# Altium schematic sheet Power.SchDoc
size A4
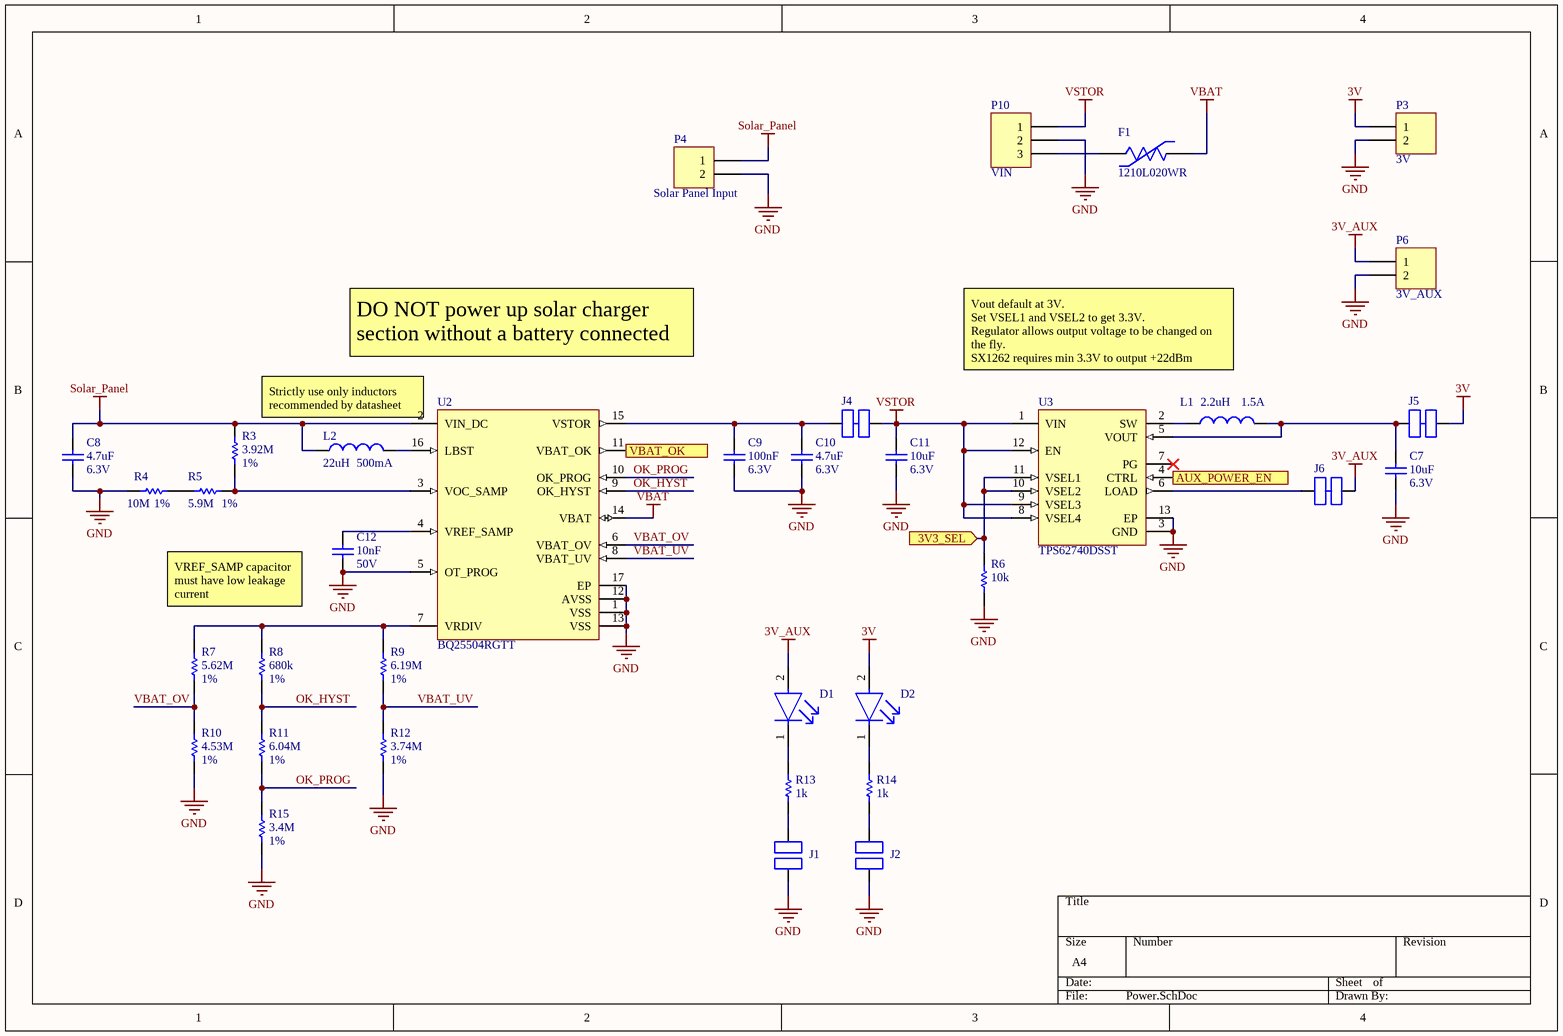
[diagram p0: Power.SchDoc]

## Parts
C7  value 10uF  Voltage: 6.3V  [0603 (1608M)]  (hidden comment: Cap)
C8  value 4.7uF  Voltage: 6.3V  [0603 (1608M)]  (hidden comment: Cap)
C9  value 100nF  Voltage: 6.3V  [0603 (1608M)]  (hidden comment: Cap)
C10  value 4.7uF  Voltage: 6.3V  [0603 (1608M)]  (hidden comment: Cap)
C11  value 10uF  Voltage: 6.3V  [0603 (1608M)]  (hidden comment: Cap)
C12  value 10nF  Voltage: 50V  [0603 (1608M)]  (hidden comment: Cap)
D1  SML-D12P8WT86  [FP-SML-D12-MFG]  (value not drawn)
D2  SML-D12P8WT86  [FP-SML-D12-MFG]  (value not drawn)
F1  1210L020WR  [FP-1210L-MFG]
J1  Open Jumper  [Jumper (Open)]  (value not drawn)  (no BOM)
J2  Open Jumper  [Jumper (Open)]  (value not drawn)  (no BOM)
J4  Closed Jumper  [Jumper (Close)]  (value not drawn)  (net tie, no BOM)
J5  Closed Jumper  [Jumper (Close)]  (value not drawn)  (net tie, no BOM)
J6  Closed Jumper  [Jumper (Close)]  (value not drawn)  (net tie, no BOM)
L1  Parameter 1: 2.2uH  Parameter 2: 1.5A  [SMD-1008]  (hidden comment: 74479787222)
L2  Inductance: 22uH  Current: 500mA  [WE-TPC 2828]  (hidden comment: 744025220)
P3  3V  [HDR1X2]
P4  Solar Panel Input  [HDR1X2]
P6  3V_AUX  [HDR1X2]
P10  VIN  [HDR1X3]
R3  value 3.92M  Tolerance: 1%  [0603 (1608M)]  (hidden comment: Resistor)
R4  value 10M  Tolerance: 1%  [0603 (1608M)]  (hidden comment: Resistor)
R5  value 5.9M  Tolerance: 1%  [0603 (1608M)]  (hidden comment: Resistor)
R6  value 10k  [0603 (1608M)]  (hidden comment: Resistor)
R7  value 5.62M  Tolerance: 1%  [0603 (1608M)]  (hidden comment: Resistor)
R8  value 680k  Tolerance: 1%  [0603 (1608M)]  (hidden comment: Resistor)
R9  value 6.19M  Tolerance: 1%  [0603 (1608M)]  (hidden comment: Resistor)
R10  value 4.53M  Tolerance: 1%  [0603 (1608M)]  (hidden comment: Resistor)
R11  value 6.04M  Tolerance: 1%  [0603 (1608M)]  (hidden comment: Resistor)
R12  value 3.74M  Tolerance: 1%  [0603 (1608M)]  (hidden comment: Resistor)
R13  value 1k  [0603 (1608M)]  (hidden comment: Resistor)
R14  value 1k  [0603 (1608M)]  (hidden comment: Resistor)
R15  value 3.4M  Tolerance: 1%  [0603 (1608M)]  (hidden comment: Resistor)
U2  BQ25504RGTT  [RGT0016C_V]
U3  TPS62740DSST  [DSS0012A_V]

## Ports
3V3_SEL (in), AUX_POWER_EN (in), VBAT_OK (out)

## Nets
3V: D2.2(A) J5.2 P3.1
3V_AUX: D1.2(A) J6.2 P6.1
GND: C7.1 C8.1 C9.1 C10.1 C11.1 C12.1 J1.1 J2.1 P3.2 P4.2 P6.2 P10.2 R4.1 R6.1 R10.1 R12.1 R15.1 U2.1(VSS) U2.5(OT_PROG) U2.12(AVSS) U2.13(VSS) U2.17(EP) U3.3(GND) U3.13(EP)
Solar_Panel: C8.2 L2.1 P4.1 R3.2 U2.2(VIN_DC)
VBAT: F1.2 U2.14(VBAT)
VSTOR: C11.2 J4.2 P10.1 U3.1(VIN) U3.8(VSEL4) U3.9(VSEL3) U3.12(EN)
3V3_SEL: R6.2 U3.10(VSEL2) U3.11(VSEL1) ; port 3V3_SEL
AUX_POWER_EN: U3.4(CTRL) ; port AUX_POWER_EN
OK_HYST: R8.1 R11.2 U2.9(OK_HYST)
OK_PROG: R11.1 R15.2 U2.10(OK_PROG)
VBAT_OK: U2.11(VBAT_OK) ; port VBAT_OK
VBAT_OV: R7.1 R10.2 U2.6(VBAT_OV)
VBAT_UV: R9.1 R12.2 U2.8(VBAT_UV)
NetC7_2: C7.2 J5.1 L1.2 U3.5(VOUT)
NetC9_2: C9.2 C10.2 J4.1 U2.15(VSTOR)
NetC12_2: C12.2 U2.4(VREF_SAMP)
NetD1_1: D1.1(C) R13.2
NetD2_1: D2.1(C) R14.2
NetF1_1: F1.1 P10.3
NetJ1_2: J1.2 R13.1
NetJ2_2: J2.2 R14.1
NetJ6_1: J6.1 U3.6(LOAD)
NetL1_1: L1.1 U3.2(SW)
NetL2_2: L2.2 U2.16(LBST)
NetR3_1: R3.1 R5.2 U2.3(VOC_SAMP)
NetR4_2: R4.2 R5.1
NetR7_2: R7.2 R8.2 R9.2 U2.7(VRDIV)

Not connected (* = marked no-connect by the designer): U3 7(PG)*

## Notes on the sheet
- DO NOT power up solar charger section without a battery connected
- Vout default at 3V.
  Set VSEL1 and VSEL2 to get 3.3V.
  Regulator allows output voltage to be changed on the fly.
  SX1262 requires min 3.3V to output +22dBm
- (near U2) Strictly use only inductors recommended by datasheet
- VREF_SAMP capacitor must have low leakage current

## Library data of the parts
C7-C12 = Cap: Capacitor
D1 D2 = CMP-08952-000019-1: LED GREEN DIFFUSED 0603 SMD; Manufacturer: Rohm; Forward Current: 20mA; Luminous Intensity: 6.3mcd; Led Orientation: Top View; Forward Voltage: 2.2V; Power Dissipation: 54mW; Reverse Voltage: 5V; Wavelength: 560nm; Colour: Green; Temperature Range Low: -40°C; ComponentLink2URL: https://d1d2qsbl8m0m72.cloudfront.net/en/products/databook/datasheet/opto/led/chip_mono/sml-d12x8_d13x8-e.pdf; Category: Diode; Device Class L2: LEDs; Package: SML-D12; Digikey Description: LED GREEN DIFFUSED 0603 SMD; Mouser Description: SML-D12 Series Green 0603 Diffused 6.3 mcd 2.2 V Surface Mount LED; RoHS: TRUE; Temperature Range High: +85°C; Octopart: https://octopart.com/sml-d12p8wt86-rohm-9289138; Height: 0.65mm; Lead Free: Yes; Device Class L1: Optoelectronics; ComponentLink2Description: Datasheet; Manufacturer Part Number: SML-D12P8WT86; Temperature: -40°C to +85°C; Device Class L3: unset; Automotive: No
F1 = CMP-08606-000032-1: PTC RESET FUSE 30V 200MA 1210; Manufacturer: Littelfuse; Resistance: 0.8-5Ω; Hold Current: 0.2A; Trip Time: 0.02s; Value: 0.8-5Ω; Description: PTC Resettable Fuse 0.2A(hold) 0.4A(trip) 30VDC 10A 0.6W 0.02s 0.8Ohm SMD Solder Pad 1210 T/R; Trip Current: 0.4A; Current Rating: 10A; Device Class L3: unset; Voltage Rating: 30V; Mouser Description: PTC Resettable Fuse 0.2A(hold) 0.4A(trip) 30VDC 10A 0.6W 0.02s 0.8Ohm SMD Solder Pad 1210 T/R; RoHS: TRUE; Height: 1mm; Manufacturer Part Number: 1210L020WR; Digikey Description: PTC RESET FUSE 30V 200MA 1210; Device Class L1: Circuit Protection; Temperature Range High: +85°C; Temperature: -40°C to +85°C; Temperature Range Low: -40°C; Lead Free: Yes; Automotive: No; Package: 1210L; ComponentLink2URL: https://m.littelfuse.com/~/media/electronics/datasheets/resettable_ptcs/littelfuse_ptc_1210l_datasheet.pdf.pdf; Ambient Temperature Range High: +85°C; Device Class L2: PTC Resettable Fuses; Octopart: https://octopart.com/1210l020wr-littelfuse-673644; Ambient Temperature Range Low: -40°C; Category: Fuse; ComponentLink2Description: Datasheet
J1 J2 = Jumper (Open)
J4-J6 = Jumper (Closed)
L1 = CMP-1392-00018-1: Power Multilayer Inductor WE-PMI, L=2.20 µH; Manufacturer: Wuerth Elektronik; Inductance: 2.20 ÂµH; PackageReference: SMD-1008; ComponentLink1Description: Manufacturer URL; ComponentLink1URL: http://www.we-online.com; ComponentLink2URL: http://www.we-online.de/katalog/media/pdf/74479787222A.pdf; ComponentLink2Description: Datasheet; PartNumber: 74479787222
L2 = CMP-1479-00015-1: SMD Shielded Tiny Power Inductor WE-TPC, L=22.0 µH /; Manufacturer: Wuerth Elektronik; Inductance: 22.0 ÂµH; PackageReference: WE-TPC 2828; ComponentLink2URL: http://www.we-online.de/katalog/media/pdf/744025220.pdf; ComponentLink1Description: Manufacturer URL; PartNumber: 744025220; ComponentLink1URL: http://www.we-online.com; ComponentLink2Description: Datasheet
P3 P6 = Header 2: Header, 2-Pin; LatestRevisionDate: 17-Jul-2002; LatestRevisionNote: Re-released for DXP Platform.; Publisher: Altium Limited
P4 = Header 2: LatestRevisionDate: 17-Jul-2002; LatestRevisionNote: Re-released for DXP Platform.; Publisher: Altium Limited
P10 = Header 3: Header, 3-Pin; LatestRevisionDate: 17-Jul-2002; LatestRevisionNote: Re-released for DXP Platform.; Publisher: Altium Limited
R6 R13 R14 = Resistor: Tolerance: 5%; Published: 8-Jun-2000; LatestRevisionDate: 17-Jul-2002; LatestRevisionNote: Re-released for DXP Platform.; PackageReference: AXIAL-0.3; Publisher: Altium Limited; PackageDescription: Axial Device, Thru-Hole; 2 Leads; 0.3 in Pin Spacing
U2 = CMP-0321-00258-2: Ultra Low Power Boost Converter with Battery Management for Energy Harvester App, 0.13 V, -40 to 85 degC, 16-pin QFN (RGT), Green (RoHS & no Sb/Br); Manufacturer: Texas Instruments; Li-Ion: N; SubFamily: Battery Charge Management; Vin(Min)(V): 0.13; ComponentLink1URL: http://www.ti.com/general/docs/lit/getliterature.tsp?genericPartNumber=BQ25504&fileType=pdf; ComponentLink1Description: Datasheet; PartNumber: BQ25504RGTT; DatasheetVersion: SLUSAH0; PackageVersion: revH, Oct-2011; Lead Acid: N; PackageDescription: 16-Pin Plastic Quad Flat No-Lead, 3 x 3 mm Body, 0.5 mm Pitch, 1.7 x 1.7 mm Exposed Pad; Mounting Technology: Surface Mount; Eco-Plan: Green (RoHS & no Sb/Br); NiMH: N; PackageReference: RGT0016C; Over Voltage Protection: N; Li-Polymer: N; NiCd: N; Code_JEDEC: MO-220
U3 = CMP-0323-00573-2: Step Down Converter For Low Power Applications, 2.2 to 5.5 V VIN, -40 to 85 degC, 12-Pin WSON (DSS), RoHS, Tape and Reel; VIN Min: 2.2 V; VOUT Max: 3.3 V; VOUT Min: 1.8 V; VIN Max: 5.5 V; PackageVersion: 4209244/C, 07/2011; ComponentLink1URL: http://www.ti.com/; Packing: Tape and Reel; PartNumber: TPS62740; ComponentLink2URL: http://www.ti.com/lit/ds/symlink/tps62740.pdf; RoHS: TRUE; ComponentLink3Description: Package Specification; Temperature Min: -40 degC; ComponentLink1Description: Manufacturer URL; PackageReference: DSS0012A; ComponentLink2Description: Datasheet; DatasheetVersion: SLVSB02B; Temperature Max: 85 degC; ComponentLink3URL: http://www.ti.com/litv/pdf/mpds336b; PackageDescription: 12-Pin Plastic Small Outline, Body 3 x 2 mm, Pitch 0.5 mm; Mounting Technology: Surface Mount
R3-R5 R7-R12 R15 = Resistor: Published: 8-Jun-2000; LatestRevisionDate: 17-Jul-2002; LatestRevisionNote: Re-released for DXP Platform.; PackageReference: AXIAL-0.3; Publisher: Altium Limited; PackageDescription: Axial Device, Thru-Hole; 2 Leads; 0.3 in Pin Spacing